# Altium schematic sheet GS_2CH_PIC18F57Q43.SchDoc
size A3; Date: 2025/12/1; DrawnBy: 付浩为; Revision: V1.00; SheetNumber: 3; SheetTotal: 3; PageSetup: Record=PageOptions|CenterHorizontal=True|CenterVertical=True|PrintScale=0.53|XCorrection=1.00|YCorrection=1.00|PrintKind=1|BorderSize=5000000|LeftOffset=0|BottomOffset=0|Orientation=2|PaperLength=1000|PaperWidth=1000|Scale=100|PaperSource=7|PrintQuality=600|MediaType=1|DitherType=10|PaperKind=A3|PrintScaleMode=1; Size: A3; Model: GS_2CH_PIC18F57Q43; Dpartment: R&D
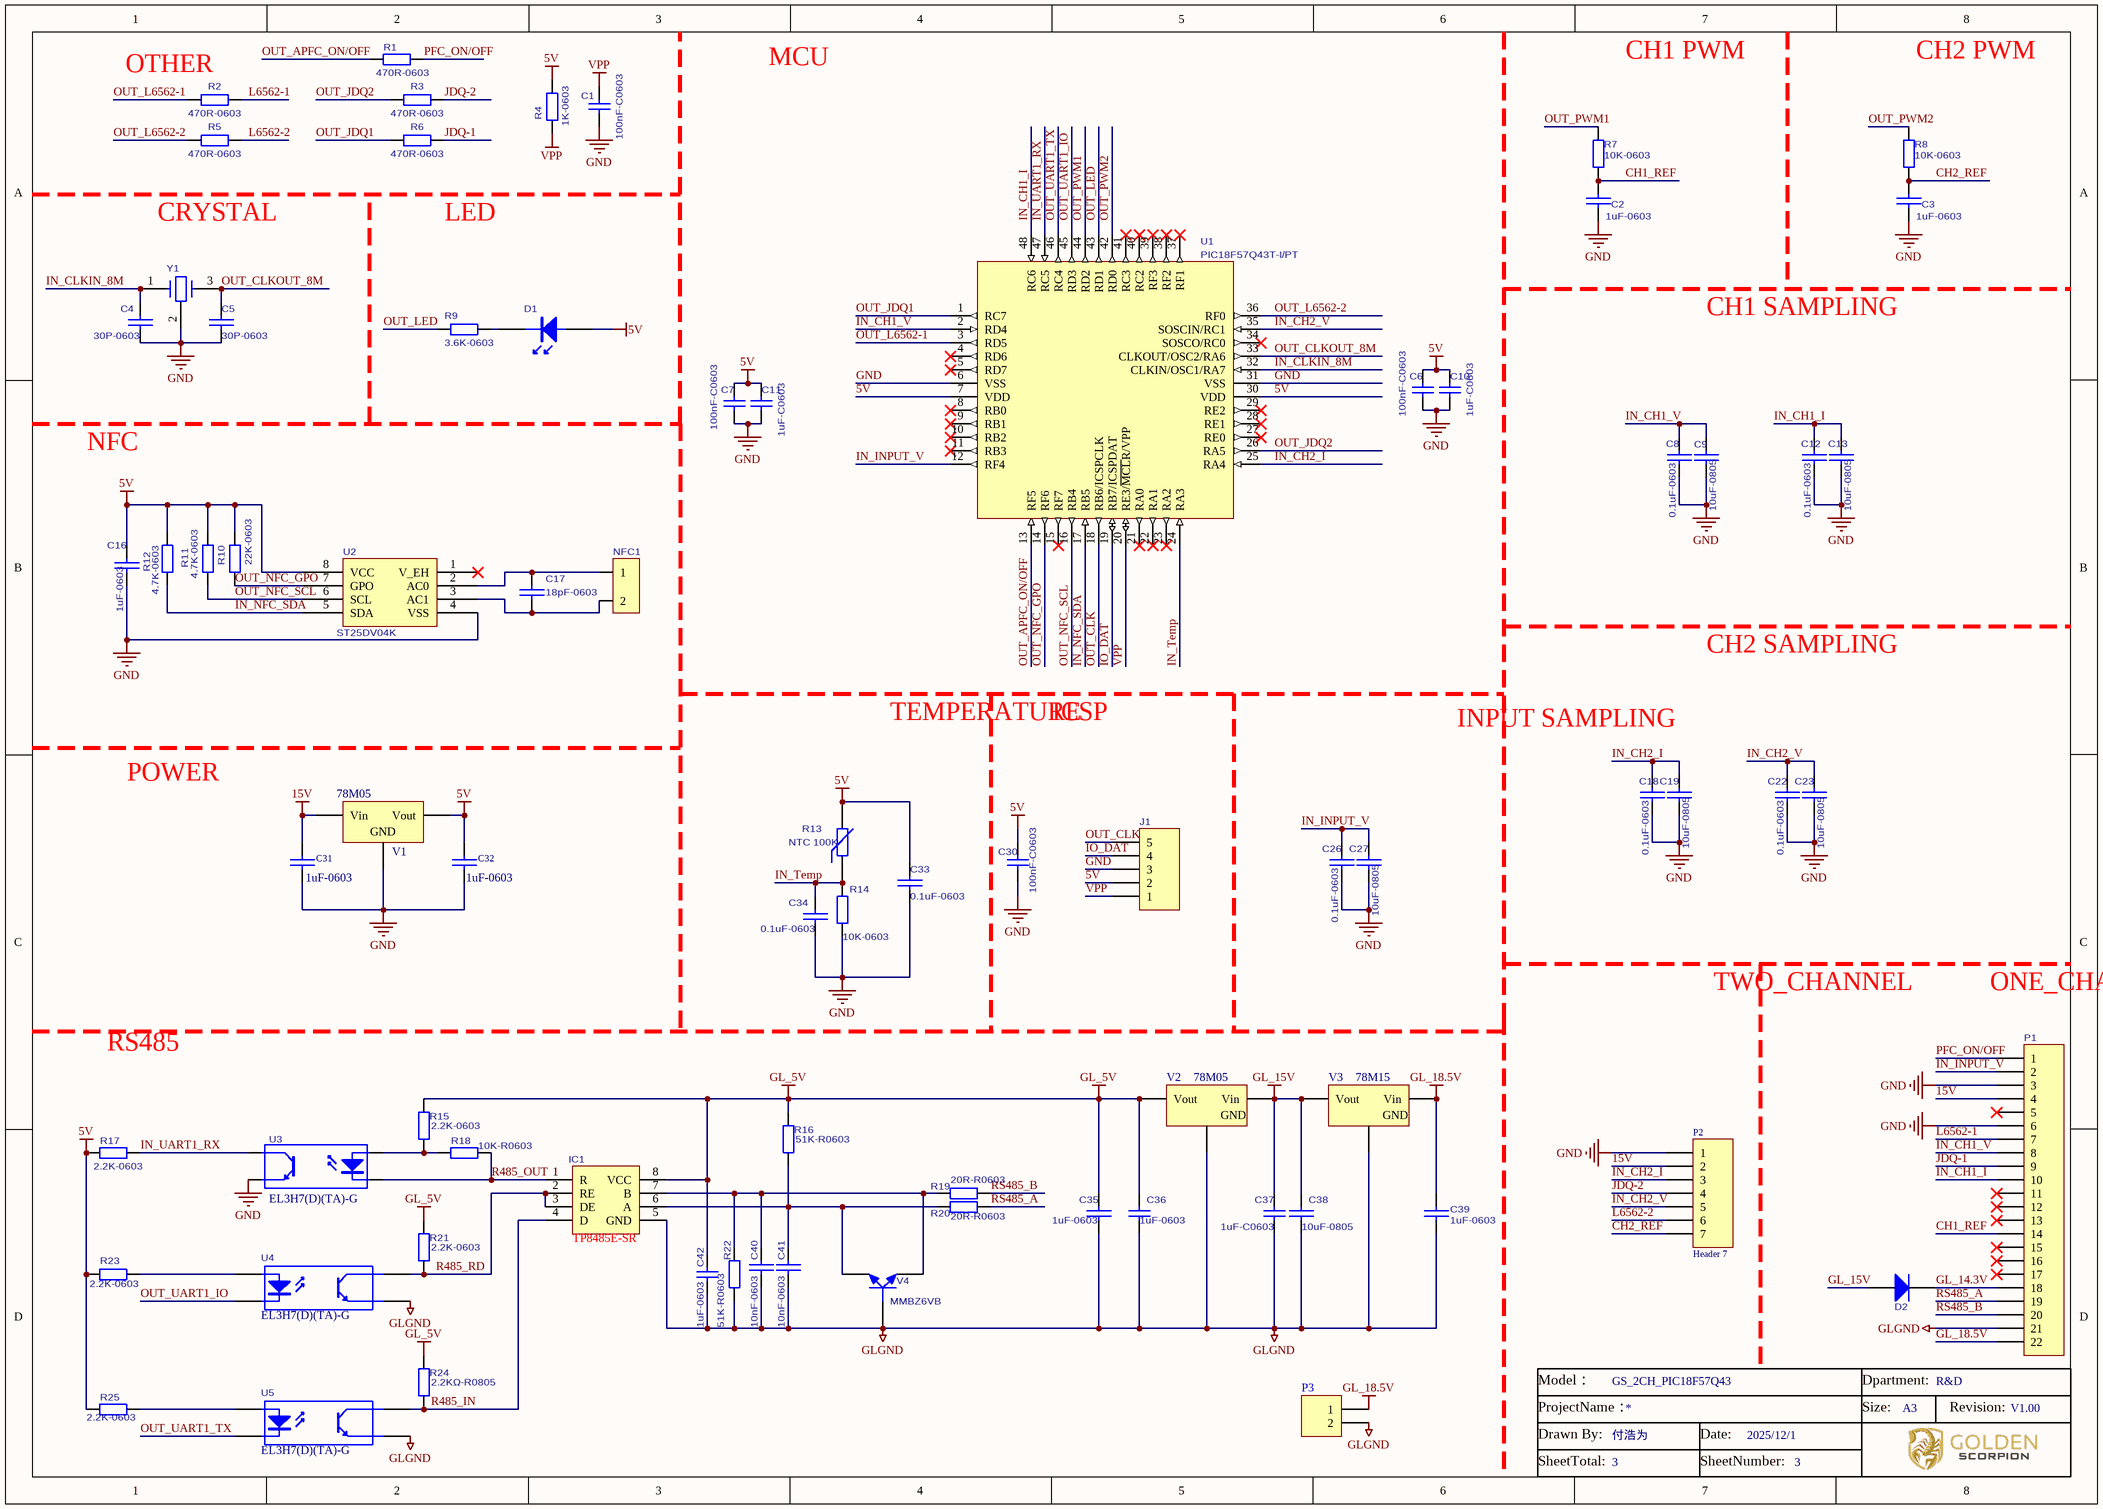
[diagram p0: GS_2CH_PIC18F57Q43.SchDoc]

## Parts
C1  100nF-C0603  [_0603]
C2  301010  [_0603]  (value not drawn)
C3  301010  [_0603]  (value not drawn)
C4  30P-0603  [_0603]
C5  30P-0603  [_0603]
C6  100nF-C0603  [_0603]
C7  100nF-C0603  [_0603]
C8  0.1uF-0603  [_0603]
C9  10uF-0805  [_0603]
C10  1uF-C0603  [_0603]
C11  1uF-C0603  [_0603]
C12  0.1uF-0603  [_0603]
C13  10uF-0805  [_0603]
C16  1uF-0603  [_0603]
C17  18pF-0603  [_0603]
C18  0.1uF-0603  [_0603]
C19  10uF-0805  [_0603]
C22  0.1uF-0603  [_0603]
C23  10uF-0805  [_0603]
C26  0.1uF-0603  [_0603]
C27  10uF-0805  [_0603]
C30  100nF-C0603  [_0603]
C31  value 1uF-0603  [RW0603]  (hidden comment: 301031)
C32  value 1uF-0603  [RW0603]  (hidden comment: 301031)
C33  0.1uF-0603  [RW0603]
C34  0.1uF-0603  [RW0603]
C35  1uF-0603  [_0603]
C36  1uF-0603  [_0603]
C37  1uF-C0603  [1206C]
C38  10uF-0805  [_0603]
C39  1uF-0603  [_0603]
C40  10nF-0603  [_0603]
C41  10nF-0603  [_0603]
C42  1uF-0603  [_0603]
D1  LED  [LED1]  (value not drawn)
D2  M7  [M7]  (value not drawn)
IC1  TP8485E-SR  [SO-8]
J1  Header 5  [Fe-HDR1X5/2.54-S]  (value not drawn)
NFC1  2PIN  [NFC天线]  (value not drawn)
P1  Header 22  [HDR1X22]  (value not drawn)
P2  Header 7
P3  322005  [2针排座]  (value not drawn)
R1  470R-0603  [_0603]
R2  470R-0603  [_0603]
R3  470R-0603  [_0603]
R4  1K-0603  [RW0603]
R5  470R-0603  [_0603]
R6  470R-0603  [_0603]
R7  value 10K-0603  [_0603]  (hidden comment: 303130)
R8  value 10K-0603  [_0603]  (hidden comment: 303130)
R9  3.6K-0603  [_0603]
R10  22K-0603  [_0603]
R11  4.7K-0603  [_0603]
R12  4.7K-0603  [_0603]
R13  NTC 100K  [RW0805]
R14  10K-0603  [RW0603]
R15  2.2K-0603  [_0603]
R16  51K-R0603  [_0603]
R17  2.2K-0603  [_0603]
R18  10K-R0603  [_0603]
R19  20R-R0603  [_0603]
R20  20R-R0603  [_0603]
R21  2.2K-0603  [_0603]
R22  51K-R0603  [_0603]
R23  2.2K-0603  [_0603]
R24  2.2KΩ-R0805  [_0603]
R25  2.2K-0603  [_0603]
U1  value PIC18F57Q43T-I/PT  [PIC18F57Q43]
U2  ST25DV04K  [SO-8]
U3  EL3H7(D)(TA)-G  [光耦]
U4  EL3H7(D)(TA)-G  [光耦]
U5  EL3H7(D)(TA)-G  [光耦]
V1  78M05  [78M05]
V2  78M05  [78M05]
V3  78M15  [78M05]
V4  MMBZ6VB  [三极管-SOT-23]
Y1  crystal  [三腿晶振(贴片)]  (value not drawn)

## Nets
5V: C6.1 C7.1 C10.1 C11.1 C16.1 C30.1 C32.1 C33.2 D1.1 J1.2 R4.2 R10.2 R11.2 R12.2 R13.2 R17.1 R23.1 R25.1 U1.7(VDD) U1.30(VDD) U2.8(VCC) V1.3(Vout)
15V: C31.1 P1.4 P2.2 V1.1(Vin)
GL_5V: C35.2 C36.2 C42.1 IC1.8(VCC) R15.2 R16.2 R21.2 R24.2 V2.3(Vout)
GL_15V: C37.1 C38.2 D2.1(A) V2.1(Vin) V3.3(Vout)
GL_18.5V: C39.1 P1.22 P3.1 V3.1(Vin)
GLGND: C35.1 C36.1 C37.2 C38.1 C39.2 C40.2 C41.2 C42.2 IC1.5(GND) P1.21 P3.2 R22.1 U4.3(E) U5.3(E) V2.2(GND) V3.2(GND) V4.3(B)
GND: C1.1 C2.1 C3.1 C4.2 C5.2 C6.2 C7.2 C8.1 C9.1 C10.2 C11.2 C12.1 C13.1 C16.2 C18.1 C19.1 C22.1 C23.1 C26.1 C27.1 C30.2 C31.2 C32.2 C33.1 C34.2 J1.3 P1.3 P1.6 P2.1 R14.1 U1.6(VSS) U1.31(VSS) U2.4(VSS) U3.3(E) V1.2(GND) Y1.2
VPP: C1.2 J1.1 R4.1 U1.20(RE3/~{MCL}R/VPP)
CH1_REF: C2.2 P1.14 R7.1
CH2_REF: C3.2 P2.7 R8.1
GL_14.3V: D2.2 P1.18
IN_CH1_I: C12.2 C13.2 P1.10 U1.48(RC6)
IN_CH1_V: C8.2 C9.2 P1.8 U1.2(RD4)
IN_CH2_I: C18.2 C19.2 P2.3 U1.25(RA4)
IN_CH2_V: C22.2 C23.2 P2.5 U1.35(SOSCIN/RC1)
IN_CLKIN_8M: C4.1 U1.32(CLKIN/OSC1/RA7) Y1.1
IN_INPUT_V: C26.2 C27.2 P1.2 U1.12(RF4)
IN_NFC_SDA: R12.1 U1.17(RB5) U2.5(SDA)
IN_Temp: C34.1 R13.1 R14.2 U1.24(RA3)
IN_UART1_RX: R17.2 U1.47(RC5) U3.4(C)
IO_DAT: J1.4 U1.19(RB7/ICSPDAT)
JDQ-1: P1.9 R6.1
JDQ-2: P2.4 R3.1
L6562-1: P1.7 R2.1
L6562-2: P2.6 R5.1
OUT_APFC_ON/OFF: R1.2 U1.13(RF5)
OUT_CLK: J1.5 U1.18(RB6/ICSPCLK)
OUT_CLKOUT_8M: C5.1 U1.33(CLKOUT/OSC2/RA6) Y1.3
OUT_JDQ1: R6.2 U1.1(RC7)
OUT_JDQ2: R3.2 U1.26(RA5)
OUT_L6562-1: R2.2 U1.3(RD5)
OUT_L6562-2: R5.2 U1.36(RF0)
OUT_LED: R9.2 U1.43(RD1)
OUT_NFC_GPO: R10.1 U1.14(RF6) U2.7(GPO)
OUT_NFC_SCL: R11.1 U1.16(RB4) U2.6(SCL)
OUT_PWM1: R7.2 U1.44(RD2)
OUT_PWM2: R8.2 U1.42(RD0)
OUT_UART1_IO: U1.45(RD3) U4.2(K)
OUT_UART1_TX: U1.46(RC4) U5.2(K)
PFC_ON/OFF: P1.1 R1.1
R485_IN: IC1.4(D) R24.1 U5.4(C)
R485_OUT: IC1.1(R) R18.1 U3.2(K)
R485_RD: IC1.2(RE) IC1.3(DE) R21.1 U4.4(C)
RS485_A: P1.19 R20.1
RS485_B: P1.20 R19.1
NetC17_1: C17.1 NFC1.1 U2.2(AC0)
NetC17_2: C17.2 NFC1.2 U2.3(AC1)
NetC40_1: C40.1 IC1.7(B) R19.2 R22.2 V4.1(E)
NetC41_1: C41.1 IC1.6(A) R16.1 R20.2 V4.2(C)
NetD1_2: D1.2 R9.1
NetR15_1: R15.1 R18.2 U3.1(A)
NetR23_2: R23.2 U4.1(A)
NetR25_2: R25.2 U5.1(A)

Not connected (* = marked no-connect by the designer): P1 5* 11* 12* 13* 15* 16* 17*; U1 4(RD6)* 5(RD7)* 8(RB0)* 9(RB1)* 10(RB2)* 11(RB3)* 15(RF7)* 21(RA0)* 22(RA1)* 23(RA2)* 27(RE0)* 28(RE1)* 29(RE2)* 34(SOSCO/RC0)* 37(RF1)* 38(RF2)* 39(RF3)* 40(RC2)* 41(RC3)*; U2 1(V_EH)*

## Notes on the sheet
- OTHER
- MCU
- CH1 PWM
- CH2 PWM
- CRYSTAL
- LED
- CH1 SAMPLING
- NFC
- TEMPERATURE
- ICSP
- CH2 SAMPLING
- POWER
- INPUT SAMPLING
- TWO_CHANNEL
- ONE_CHANNEL
- RS485
- Model：
- Dpartment:
- ProjectName：
- Drawn By:
- Date:
- Size:
- Revision:
- SheetTotal:
- SheetNumber:
- (in symbol CAP) 1uF-0603

## Library data of the parts
C1 C37 = Cap: Capacitor; Published: 8-Jun-2000; LatestRevisionDate: 17-Jul-2002; LatestRevisionNote: Re-released for DXP Platform.; PackageReference: RAD-0.3; Publisher: Altium Limited
C2 C3 C9 C13 C19 C23 C27 C33 = CAP: 贴片电容
C4 C5 C40 C41 = C
C6 C7 C10 C11 C30 = Cap: Capacitor; Value: 100nF; Published: 8-Jun-2000; LatestRevisionDate: 17-Jul-2002; LatestRevisionNote: Re-released for DXP Platform.; PackageReference: RAD-0.3; Publisher: Altium Limited
C8 C12 C18 C22 C26 = CAP: ff
C16 = C: 贴片电容; value: 0.1uF-0603
C17 C31 C32 C34 = C: 贴片电容
  C34: Value: 0.1uF-0603
C35 C38 = CAP: Capacitor
C36 = Cap: Capacitor; Value: 0.1uF/0603; Published: 8-Jun-2000; LatestRevisionDate: 17-Jul-2002; LatestRevisionNote: Re-released for DXP Platform.; PackageReference: RAD-0.3; Publisher: Altium Limited
C39 = C: 贴片电容; Value: 0.1uF-0603
C42 = Cap: Capacitor; Value: 1uF/0603; Published: 8-Jun-2000; LatestRevisionDate: 17-Jul-2002; LatestRevisionNote: Re-released for DXP Platform.; PackageReference: RAD-0.3; Publisher: Altium Limited
D2 = Diode: Default Diode; Published: 8-Jun-2000; LatestRevisionDate: 17-Jul-2002; LatestRevisionNote: Re-released for DXP Platform.; PackageVersion: Sep-1996; PackageReference: SMC; Publisher: Altium Limited; PackageDescription: DO-214-AB/SMC; 2 C-Bend Leads; Body 7.9 x 5.9 mm, inc. leads (LxW); Code_JEDEC: DO-214-AB
IC1 = MAX1483
J1 = Header 5: Header, 5-Pin; LatestRevisionDate: 17-Jul-2002; LatestRevisionNote: Re-released for DXP Platform.; Publisher: Altium Limited
NFC1 = 2PIN: 8-Pin, 2mm; LatestRevisionDate: 17-Jul-2002; LatestRevisionNote: Re-released for DXP Platform.; Publisher: Altium Limited
P1 = Header 22: Header, 22-Pin; LatestRevisionDate: 17-Jul-2002; LatestRevisionNote: Re-released for DXP Platform.; Publisher: Altium Limited
P3 = Header 2: Header, 2-Pin; LatestRevisionDate: 17-Jul-2002; LatestRevisionNote: Re-released for DXP Platform.; Publisher: Altium Limited
R1-R8 R10-R12 R14 R17 = Res2: 贴片电阻; Published: 8-Jun-2000; LatestRevisionDate: 17-Jul-2002; LatestRevisionNote: Re-released for DXP Platform.; PackageReference: AXIAL-0.4; Publisher: Altium Limited
  R1-R3 R5 R6: PackageDescription: Axial Device, Thru-Hole; 2 Leads; 0.4 in Pin Spacing; Value: 470R-0603
  R4: Value: 1K-0603
  R10: Value: 22K-0603
  R11 R12: Value: 4.7K-0603
  R14: Value: 10K-0603
  R17: Value: 2.2K-0603
R9 = Res2: Resistor; Value: 2.2K; Published: 8-Jun-2000; LatestRevisionDate: 17-Jul-2002; LatestRevisionNote: Re-released for DXP Platform.; PackageReference: AXIAL-0.4; Publisher: Altium Limited; PackageDescription: Axial Device, Thru-Hole; 2 Leads; 0.4 in Pin Spacing
R13 = Res Varistor: 贴片热敏; Published: 24-Mar-1999; LatestRevisionDate: 04-Mar-2005; LatestRevisionNote: PCB Footprint replaced.; PackageReference: 6-0805; Publisher: Altium Limited
R15 R16 R18-R25 = Res2: 贴片电阻; Value: 2.4K-0603; Published: 8-Jun-2000; LatestRevisionDate: 17-Jul-2002; LatestRevisionNote: Re-released for DXP Platform.; PackageReference: AXIAL-0.4; Publisher: Altium Limited
U1 = A06-1695: PIC18F57Q43 microcontroller, 48-pin TQFP 7mm x 7mm x 1.0mm; PartGroup: Integrated Circuits,MCU, MPU, DSP,PIC; Manufacturer: Microchip; AN: A06-1695; Height: 1; MPN: PIC18F57Q43T-I/PT
U2 = Component_1: 贴片集成电路; Value: ST25DV04K
U3 = Optoisolator1: 贴片光耦; Published: 24-Mar-1999; LatestRevisionDate: 04-Mar-2005; LatestRevisionNote: Sch pins 3 & 4 Swapped.; DatasheetDocument: Nov-2003; PackageReference: DIP-4; Publisher: Altium Limited
U4 U5 = OPTOISO1: Optoisolator
V1-V3 = Volt Reg: 贴片稳压模块; Published: 24-Mar-1999; LatestRevisionDate: 17-Jul-2002; LatestRevisionNote: Re-released for DXP Platform.; PackageReference: D2PAK; Publisher: Altium Limited; Code_JEDEC: SMD-220
V4 = Diac-NPN: DIAC; Published: 24-Mar-1999; LatestRevisionDate: 17-Jul-2002; LatestRevisionNote: Re-released for DXP Platform.; PackageReference: TO-262-AA; Publisher: Altium Limited; Code_JEDEC: TO-262-AA